# Altium schematic sheet Temperature.SchDoc
size A
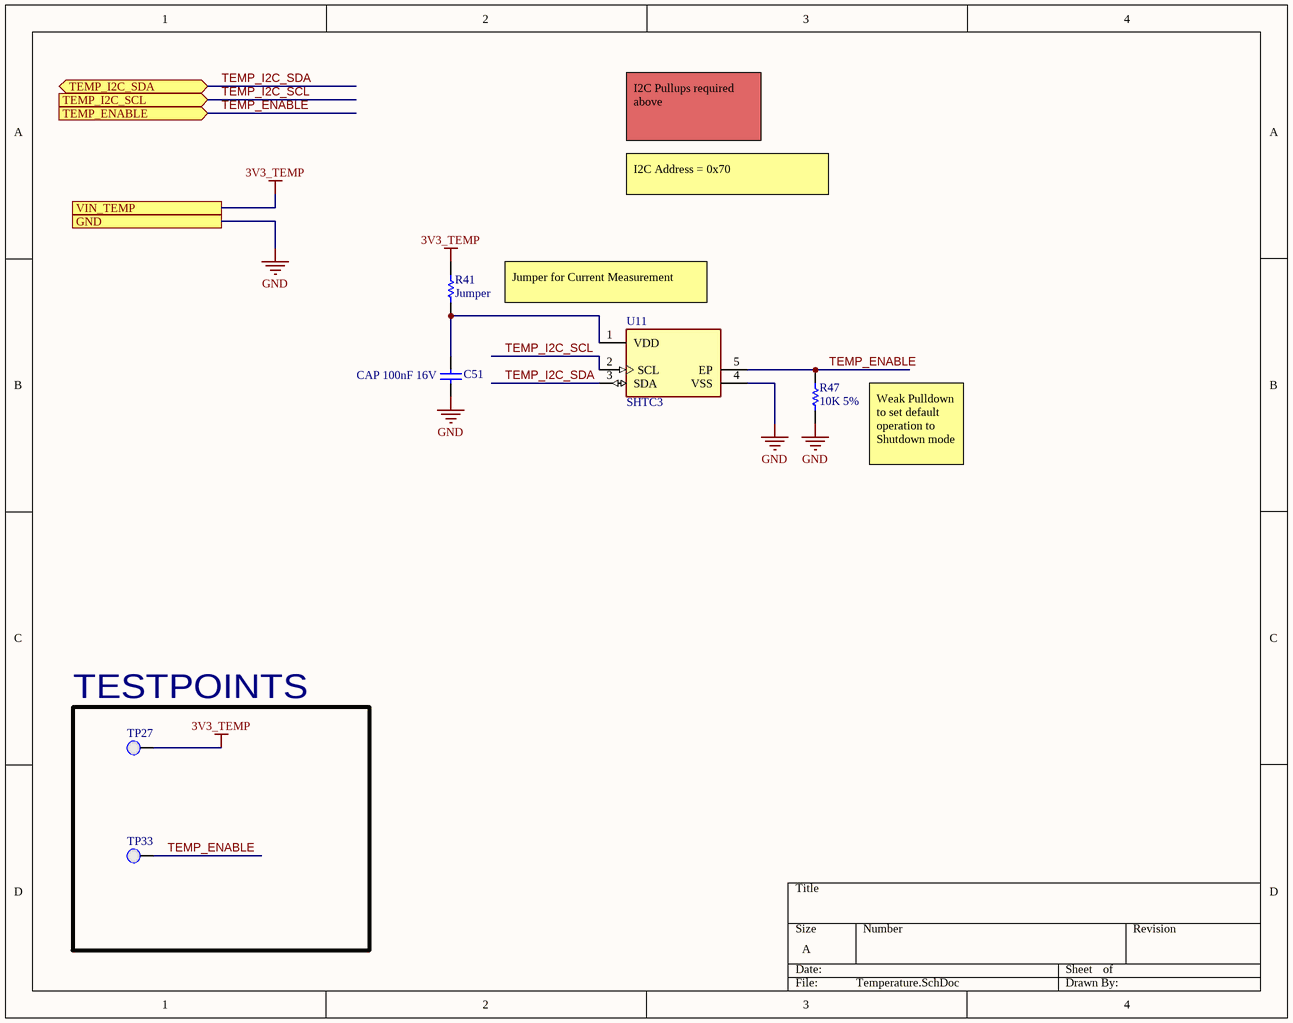
[diagram p0: Temperature.SchDoc]

## Parts
C51  CAP 100nF 16V  [CAPC0402(1005)60_M]
R41  Jumper  [RESC0805(2012)_N]
R47  10K 5%  [RESC0402(1005)_N]
TP27  0.1" Pad  [PCBComponent]  (value not drawn)
TP33  0.1" Pad  [PCBComponent]  (value not drawn)
U11  SHTC3  [FP-SHTC3-MFG]

## Blocks framed on the sheet
TESTPOINTS: TP27 TP33

## Ports
GND, TEMP_ENABLE (in), TEMP_I2C_SCL (in), TEMP_I2C_SDA (bidir), VIN_TEMP

## Nets
3V3_TEMP: R41.1 TP27.1(PAD) ; port VIN_TEMP
GND: C51.1 R47.1 U11.4(VSS) ; port GND
TEMP_ENABLE: R47.2 TP33.1(PAD) U11.5(EP) ; port TEMP_ENABLE
TEMP_I2C_SCL: U11.2(SCL) ; port TEMP_I2C_SCL
TEMP_I2C_SDA: U11.3(SDA) ; port TEMP_I2C_SDA
NetC51_2: C51.2 R41.2 U11.1(VDD)

## Notes on the sheet
- I2C Pullups required above
- I2C Address = 0x70
- Jumper for Current Measurement
- Weak Pulldown to set default operation to Shutdown mode

## Library data of the parts
C51 = CMP-1034-02069-1: CAP 100nF 16V ±10% 0402 (1005 Metric) Thickness 0.6mm SMD; Case-EIA: 0402; Case-Metric: 1005; Tolerance: Â±10%; Value: 100nF; Max Thickness: 0.6 mm; Rated Voltage: 16 V; Technology: SMT
R41 = CMP-1013-00001-1: Jumper 0805 (2012 Metric); Case-EIA: 0805; Value: 0.00 Ohm; Tolerance: None; Case-Metric: 2012; Technology: SMT; Power: None
R47 = CMP-1011-00098-1: 10K 0.063W 5% 0402 (1005 Metric)  SMD; Case-Metric: 1005; Value: 10000.00 Ohm; Case-EIA: 0402; Technology: SMT; Tolerance: 5 %; Power: 0.063 W
TP27 TP33 = 0.1" Pad-A.4
U11 = CMP-144040-000003-1: SENSOR HUMI/TEMP I2C 2% SMD; Manufacturer: Sensirion; Operating Supply Current: 0.3-900uA; Resolution: 16bits; Description: Humidity Temperature Sensor 0 ~ 100% RH I²C ±2% RH 8s Surface Mount; Min Supply Voltage: 1.62V; Max Supply Voltage: 3.6V; Category: IC; Device Class L3: unset; ComponentLink2URL: https://www.sensirion.com/fileadmin/user_upload/customers/sensirion/Dokumente/0_Datasheets/Humidity/Sensirion_Humidity_Sensors_SHTC3_Datasheet.pdf; Ipc Land Pattern Name: DFN200X200X75-4; RoHS: TRUE; Height: 0.75mm; Interface: I2C; Temperature Range High: +125°C; Accuracy: 2%; Sensor Output: I2C; Automotive: No; Package: 0; Device Class L1: Sensors; Manufacturer Part Number: SHTC3; Digikey Description: SENSOR HUMI/TEMP I2C 2% SMD; Lead Free: Yes; Temperature: -40°C to +125°C; Device Class L2: Temperature and Humidity Sensors; ComponentLink2Description: Datasheet; Octopart: https://octopart.com/shtc3-sensirion-91912225; Mouser Description: SHTC3 Series 0 to 100% RH 3.6 V Humidity and Temperature Sensor IC - DFN-4; Temperature Range Low: -40°C